# EAGLE schematic sensor (EAGLE 6.5.0)
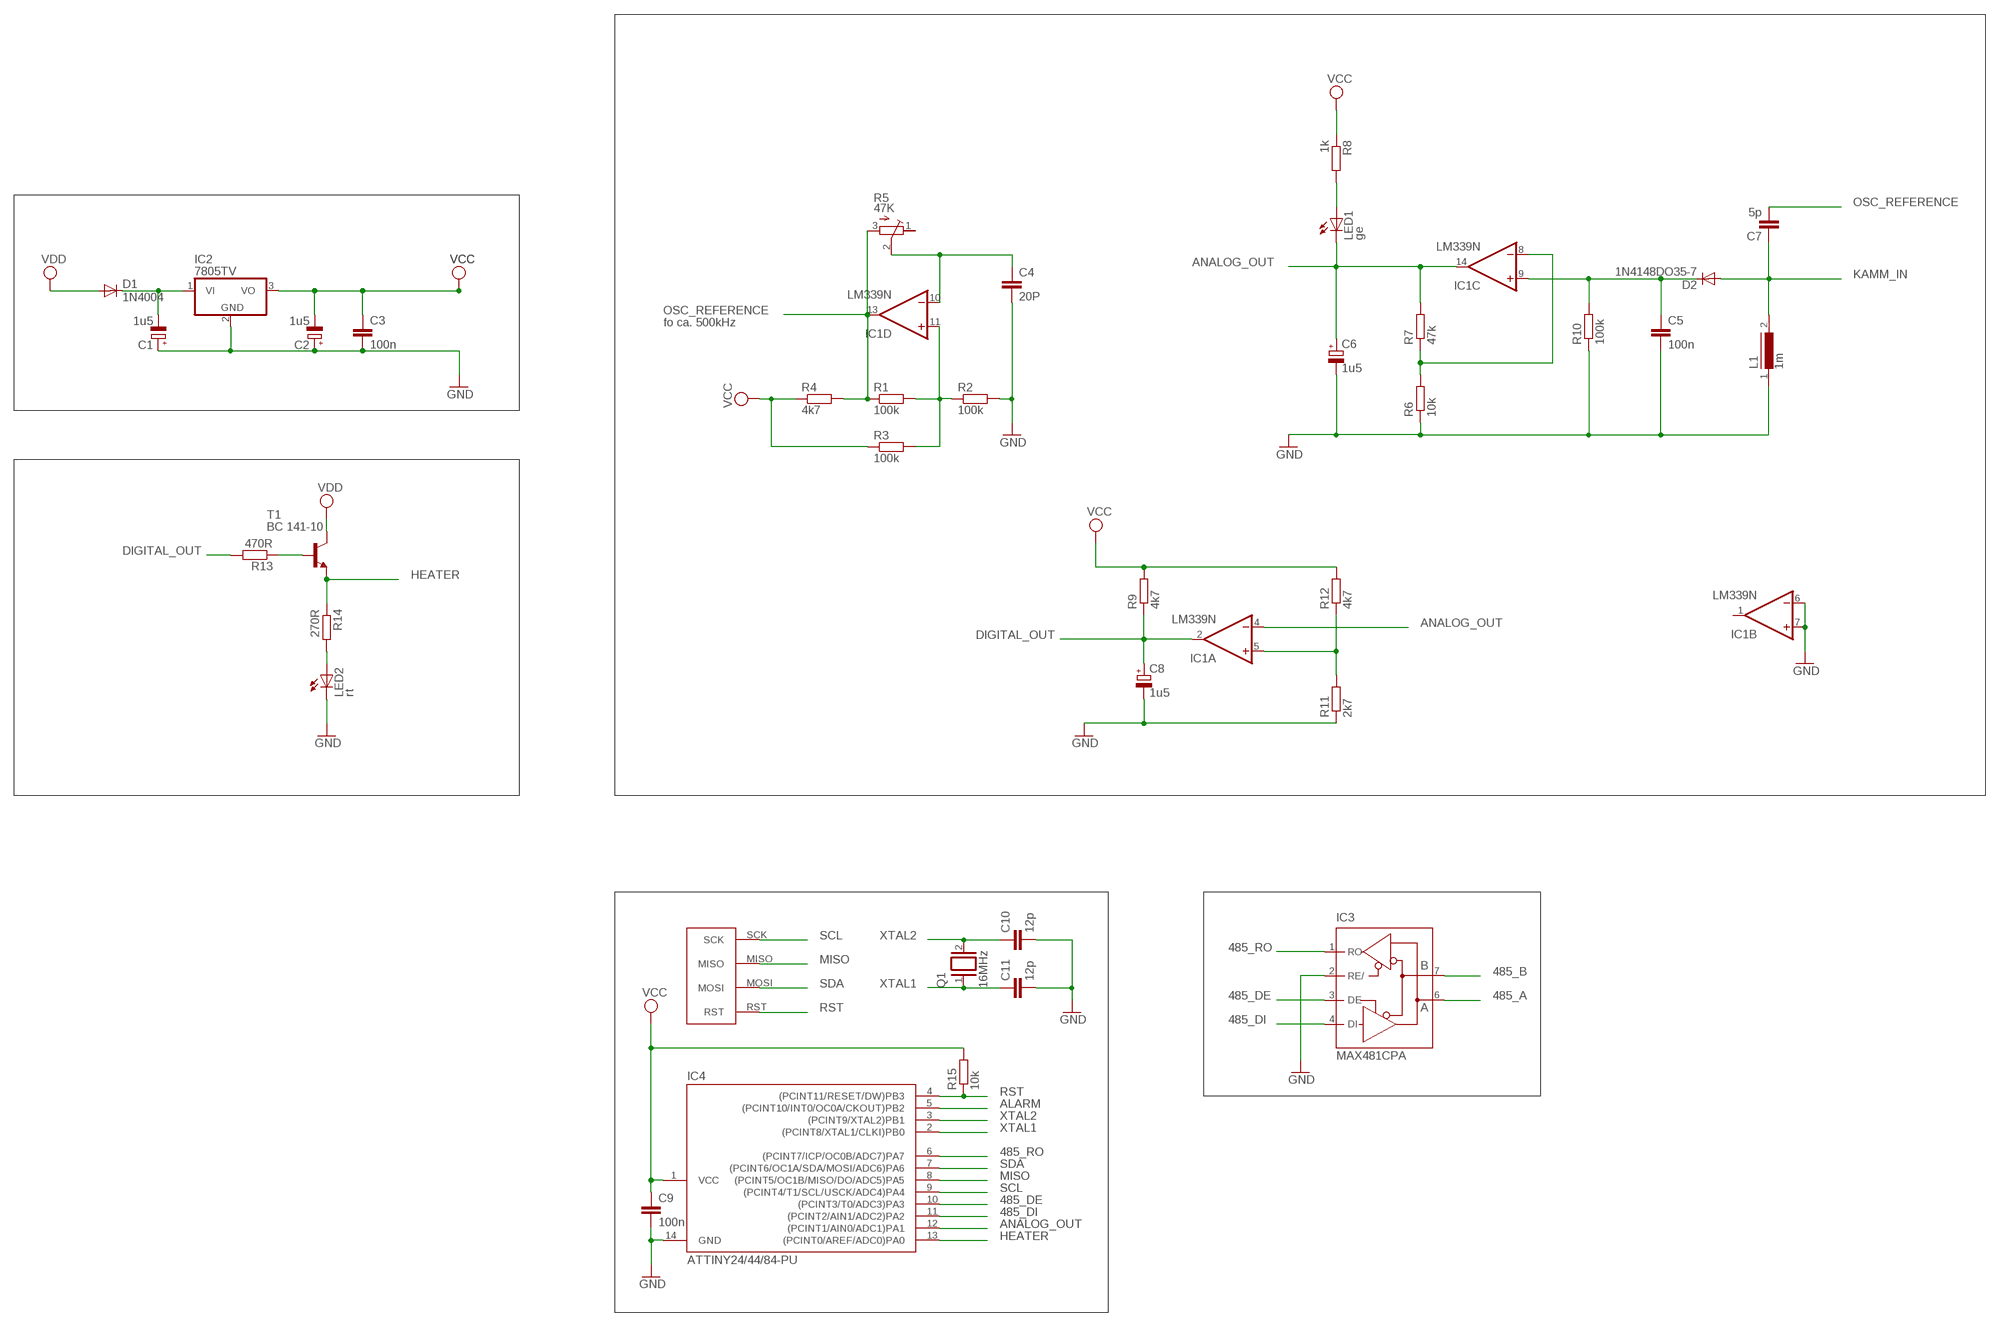
[diagram p0: schematic, sheet 1]

## Parts
C1  1u5  CPOL-EUE3.5-8  [E3,5-8]
C2  1u5  CPOL-EUE3.5-8  [E3,5-8]
C3  100n  C-EU050-025X075  [C050-025X075]
C4  20P  C-EU050-025X075  [C050-025X075]
C5  100n  C-EU050-025X075  [C050-025X075]
C6  1u5  CPOL-EUE3.5-8  [E3,5-8]
C7  5p  C-EU050-025X075  [C050-025X075]
C8  1u5  CPOL-EUE3.5-8  [E3,5-8]
C9  100n  C-EU050-025X075  [C050-025X075]
C10  12p  C-EU050-025X075  [C050-025X075]
C11  12p  C-EU050-025X075  [C050-025X075]
D1  1N4004  [DO41-10]
D2  1N4148DO35-7  [DO35-7]
IC1  LM339N  [DIL14]
IC2  7805TV  [TO220V]
IC3  MAX481CPA  [DIL08]
IC4  ATTINY24/44/84-PU  [DIL14]
L1  1m  BC12  [BC12]
LED1  ge  LED5MM  [LED5MM]
LED2  rt  LED5MM  [LED5MM]
Q1  16MHz  XTAL  [Q]
R1  100k  R-EU_0207/7  [0207/7]
R2  100k  R-EU_0207/7  [0207/7]
R3  100k  R-EU_0207/7  [0207/7]
R4  4k7  R-EU_0207/7  [0207/7]
R5  47K  R-TRIMMT93YA  [RTRIMT93YA]
R6  10k  R-EU_0207/7  [0207/7]
R7  47k  R-EU_0207/7  [0207/7]
R8  1k  R-EU_0207/7  [0207/7]
R9  4k7  R-EU_0207/7  [0207/7]
R10  100k  R-EU_0207/7  [0207/7]
R11  2k7  R-EU_0207/7  [0207/7]
R12  4k7  R-EU_0207/7  [0207/7]
R13  470R  R-EU_0207/7  [0207/7]
R14  270R  R-EU_0207/7  [0207/7]
R15  10k  R-EU_0207/7  [0207/7]
T1  BC 141-10  -NPN-TO92  [TO92]
U$1  AVR_ISP  [AVR_ISP]

## Nets
485_A: IC3.6(A)
485_B: IC3.7(B)
485_DE: IC3.3(DE) IC4.10((PCINT3/T0/ADC3)PA3)
485_DI: IC3.4(DI) IC4.11((PCINT2/AIN1/ADC2)PA2)
485_RO: IC3.1(RO) IC4.6((PCINT7/ICP/OC0B/ADC7)PA7)
ALARM: IC4.5((PCINT10/INT0/OC0A/CKOUT)PB2)
ANALOG_OUT: C6.+ IC1.4(A:-IN) IC1.14(C:OUT) IC4.12((PCINT1/AIN0/ADC1)PA1) LED1.K(C) R7.2
DIGITAL_OUT: C8.+ IC1.2(A:OUT) R9.1 R13.2
GND: C1.+ C2.+ C3.2 C4.2 C5.2 C6.- C8.- C9.2 C10.2 C11.2 IC1.6(B:-IN) IC1.7(B:+IN) IC2.2(GND) IC3.2(RE/) IC4.14(GND) L1.1 LED2.K(C) R2.2 R6.1 R10.1 R11.1
HEATER: IC4.13((PCINT0/AREF/ADC0)PA0) R14.1 T1.1(E)
KAMM_IN: C7.1 D2.A L1.2
MISO: IC4.8((PCINT5/OC1B/MISO/DO/ADC5)PA5) U$1.MISO
N$1: C1.- D1.C IC2.1(VI)
N$2: IC1.8(C:-IN) R6.2 R7.1
N$3: C4.1 IC1.10(D:-IN) R5.2(S)
N$4: IC1.11(D:+IN) R1.2 R2.1 R3.2
N$5: LED1.A R8.2
N$6: C5.1 D2.C IC1.9(C:+IN) R10.2
N$7: IC1.5(A:+IN) R11.2 R12.1
N$8: LED2.A R14.2
N$9: R13.1 T1.2(B)
OSC_REFERENCE: C7.2 IC1.13(D:OUT) R1.1 R4.2 R5.3(E)
RST: IC4.4((PCINT11/RESET/DW)PB3) R15.1 U$1.RST
SCL: IC4.9((PCINT4/T1/SCL/USCK/ADC4)PA4) U$1.SCK
SDA: IC4.7((PCINT6/OC1A/SDA/MOSI/ADC6)PA6) U$1.MOSI
VCC: C2.- C3.1 C9.1 IC2.3(VO) IC4.1(VCC) R3.1 R4.1 R8.1 R9.2 R12.2 R15.2
VDD: D1.A T1.3(C)
XTAL1: C11.1 IC4.2((PCINT8/XTAL1/CLKI)PB0) Q1.1
XTAL2: C10.1 IC4.3((PCINT9/XTAL2)PB1) Q1.2
Unconnected: IC1.1(B:OUT) R5.1(A)

## Notes on the sheet
- fo ca. 500kHz

## Power pins joined to a net without a drawn wire
GND: IC1.12(P:GND) IC3.5(GND) U$1.GND
V+: IC1.3(P:V+)
VCC: IC3.8(VCC) U$1.VCC

## Library data of the parts
C1 C2 C6 C8 = resistor:CPOL-EU: POLARIZED CAPACITOR, European symbol
C3-C5 C7 C9-C11 = resistor:C-EU: CAPACITOR, European symbol
D1 = diode:1N4004: DIODE general purpose rectifier, 1 A
D2 = diode:1N4148: DIODE high speed (Philips)
IC1 = linear:LM339: Low Power Low Offset Voltage Quad Comparators with open collector; LM139/LM239/LM339/LM2901/LM3302
IC2 = linear:78*: Positive VOLTAGE REGULATOR Source: http://cache.national.com/ds/LM/LM78L05.pdf http://www.fairchildsemi.com/ds/LM/LM7805.pdf
IC3 = maxim:MAX481CPA: RS485 TRANSEIVER; MPN: MAX481CPA+; OC_FARNELL: unknown; OC_NEWARK: 99K3445
IC4 = attiny24_44_84:ATTINY24/44/84
L1 = inductors:BC12: INDUCTOR
LED1 LED2 = led:LED: LED OSRAM: - CHIPLED LG R971, LG N971, LY N971, LG Q971, LY Q971, LO R971, LY R971 LH N974, LH R974 LS Q976, LO Q976, LY Q976 LO Q996 - Hyper CHIPLED LW Q18S LB Q993, LB Q99A, LB R99A - SideLED LS A670, LO A670, LY A670, LG A670, LP A670 LB A673, LV A673, LT A673, LW A673 LH A674 LY A675 LS A676, LA A676, LO A676, LY A676, LW A676 LS A679, LY A679, LG A679 - Hyper Micro SIDELED® LS Y876, LA Y876, LO Y876, LY Y876 LT Y87S - SmartLED LW L88C, LW L88S LB L89C, LB L89S, LG L890 LS L89K, LO L89K, LY L89K LS L896, LA L896, LO L896, LY L896 - TOPLED LS T670, LO T670, LY T670, LG T670, LP T670 LSG T670, LSP T670, LSY T670, LOP T670, LYG T670 LG T671, LOG T671, LSG T671 LB T673, LV T673, LT T673, LW T673 LH T674 LS T676, LA T676, LO T676, LY T676, LB T676, LH T676, LSB T676, LW T676 LB T67C, LV T67C, LT T67C, LS T67K, LO T67K, LY T67K, LW E67C LS E67B, LA E67B, LO E67B, LY E67B, LB E67C, LV E67C, LT E67C LW T67C LS T679, LY T679, LG T679 LS T770, LO T770, LY T770, LG T770, LP T770 LB T773, LV T773, LT T773, LW T773 LH T774 LS E675, LA E675, LY E675, LS T675 LS T776, LA T776, LO T776, LY T776, LB T776 LHGB T686 LT T68C, LB T68C - Hyper Mini TOPLED® LB M676 - Mini TOPLED Santana® LG M470 LS M47K, LO M47K, LY M47K Source: http://www.osram.convergy.de LUXEON: - LUMILED® LXK2-PW12-R00, LXK2-PW12-S00, LXK2-PW14-U00, LXK2-PW14-V00 LXK2-PM12-R00, LXK2-PM12-S00, LXK2-PM14-U00 LXK2-PE12-Q00, LXK2-PE12-R00, LXK2-PE12-S00, LXK2-PE14-T00, LXK2-PE14-U00 LXK2-PB12-K00, LXK2-PB12-L00, LXK2-PB12-M00, LXK2-PB14-N00, LXK2-PB14-P00, LXK2-PB14-Q00 LXK2-PR12-L00, LXK2-PR12-M00, LXK2-PR14-Q00, LXK2-PR14-R00 LXK2-PD12-Q00, LXK2-PD12-R00, LXK2-PD12-S00 LXK2-PH12-R00, LXK2-PH12-S00 LXK2-PL12-P00, LXK2-PL12-Q00, LXK2-PL12-R00 Source: www.luxeon.com KINGBRIGHT: KA-3528ASYC Source: www.kingbright.com
Q1 = special:XTAL: CRYSTAL
R1-R4 R6-R15 = resistor:R-EU_: RESISTOR, European symbol
R5 = resistor:R-TRIMM: Trimm resistor
T1 = transistor-neu-to92:*-NPN-: NPN Transistror
U$1 = n39:AVR_ISP: AVR ISP Pinheader Belegung: 1: MISO 2: VCC 3: SCK 4: MOSI 5: Reset 6: GND